# EAGLE design 8ball (EAGLE 8.7.1)
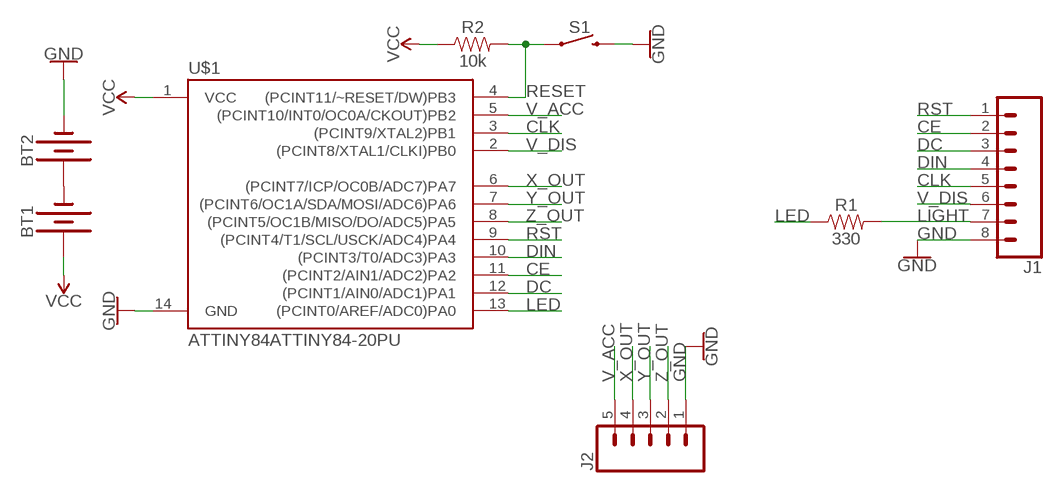
[diagram p0: schematic, sheet 1]

## Parts
BT1  BATTERY-AAA  [BATTERY-AAA]
BT2  BATTERY-AAA  [BATTERY-AAA]
J1  CONN_08FEMALE_LOCK  [1X08_FEMALE_LOCK]
J2  CONN_05LOCK  [1X05_LOCK]
R1  330  330OHM-HORIZ-1/10W-5%  [AXIAL-0.3]
R2  10k  10KOHM-HORIZ-1/6W-5%  [AXIAL-0.3]
S1  MOMENTARY-SWITCH-SPST-PTH-6.0MM-KIT  [TACTILE_SWITCH_PTH_6.0MM_KIT]
U$1  ATTINY84ATTINY84-20PU  [DIP14]

## Nets
CE: J1.2 U$1.11((PCINT2/AIN1/ADC2)PA2)
CLK: J1.5 U$1.3((PCINT9/XTAL2)PB1)
DC: J1.3 U$1.12((PCINT1/AIN0/ADC1)PA1)
DIN: J1.4 U$1.10((PCINT3/T0/ADC3)PA3)
GND: BT2.GND@1(-) J1.8 J2.1 S1.3 U$1.14(GND)
LED: R1.P$1 U$1.13((PCINT0/AREF/ADC0)PA0)
LIGHT: J1.7 R1.P$2
N$1: BT1.GND@1(-) BT2.PWR@1(+)
RESET: R2.P$2 S1.1 U$1.4((PCINT11/~RESET/DW)PB3)
RST: J1.1 U$1.9((PCINT4/T1/SCL/USCK/ADC4)PA4)
V_ACC: J2.5 U$1.5((PCINT10/INT0/OC0A/CKOUT)PB2)
V_DIS: J1.6 U$1.2((PCINT8/XTAL1/CLKI)PB0)
VCC: BT1.PWR@1(+) R2.P$1 U$1.1(VCC)
X_OUT: J2.4 U$1.6((PCINT7/ICP/OC0B/ADC7)PA7)
Y_OUT: J2.3 U$1.7((PCINT6/OC1A/SDA/MOSI/ADC6)PA6)
Z_OUT: J2.2 U$1.8((PCINT5/OC1B/MISO/DO/ADC5)PA5)

## Library data of the parts
BT1 BT2 = SparkFun-Batteries:BATTERY: Battery - Single Cell A variety of battery chemistries, sizes, and footprints. Device List: 20MM_PTH - Coin Cell Battery Holder - 20mm (PTH) <https://www.sparkfun.com/products/783> 6.8MM_PTH - Coin Cell Battery Holder - 6.8MM(SMD) <https://www.digikey.com/product-detail/en/seiko-instruments/MS621FE-FL11E/728-1057-ND/1889208?WT.srch=1&gclid=CNOQ5a6LzdQCFZS2wAodXCkE0g> 12MM_SMD - Coin Cell Battery Holder - 12mm (SMD) <https://www.sparkfun.com/products/10592> 12MM_PTH - Coin Cell Battery Holder - 12mm (PTH) <https://www.sparkfun.com/products/7948> 20MM_SMD - 20mm Coin Cell Battery Holder (SMD) (2 legs) Used on the Big Time Watch Kit <https://www.sparkfun.com/products/11734> 20MM_SMD_4LEGS - Coin Cell Battery Holder - 20mm (SMD) <https://www.sparkfun.com/products/11892> 20MM_SMD_4LEGS_OVERPASTE - Coin Cell Battery Holder - 20mm (SMD) <https://www.sparkfun.com/products/11892> (Over-paste on the legs) 24.5MM_PTH - Coin Cell Battery Holder - 24.5mm (PTH) <https://www.sparkfun.com/products/8863> 9V - 9V Battery Holder - PC Mount Used on the SparkFun SparkPunk Sound Kit <https://www.sparkfun.com/products/11177> and SparkFun SparkPunk Sequencer Kit <https://www.sparkfun.com/products/12707> 18650 - Battery Holder - 18650 (PTH) <https://www.sparkfun.com/products/13113> AA - Battery Holder - 1xAA (PTH) <https://www.sparkfun.com/products/7949> AAA - Battery Holder - 1xAAA (PTH) <https://www.sparkfun.com/products/12718> AA_KIT - Battery Holder - 1xAA (PTH) <https://www.sparkfun.com/products/7949> Special kit package - pads only have exposed copper on one side of the board. AAA_KIT - Battery Holder - 1xAAA (PTH) <https://www.sparkfun.com/products/12718> Special kit package - pads only have exposed copper on one side of the board.; PROD_ID: BATT-08571; SF_SKU: PRT-12718
J1 = SparkFun-Connectors:CONN_08: Multi connection point. Often used as Generic Header-pin footprint for 0.1 inch spaced/style header connections On any of the 0.1 inch spaced packages, you can populate with these: Break Away Headers - Straight <https://www.sparkfun.com/products/116> (PRT-00116) Break Away Male Headers - Right Angle <https://www.sparkfun.com/products/553> (PRT-00553) Female Headers <https://www.sparkfun.com/products/115> (PRT-00115) Break Away Headers - Machine Pin <https://www.sparkfun.com/products/117> (PRT-00117) Break Away Female Headers - Swiss Machine Pin <https://www.sparkfun.com/products/743> (PRT-00743) Arduino Stackable Header - 8 Pin <https://www.sparkfun.com/products/9279> (PRT-09279) For SCREWTERMINALS and SPRING TERMINALS visit here: Screw Terimnals on SparkFun.com <https://www.sparkfun.com/search/results?term=Screw+Terminals> (5mm/3.5mm/2.54mm spacing) This device is also useful as a general connection point to wire up your design to another part of your project. Our various solder wires solder well into these plated through hole pads. Hook-Up Wire - Assortment (Stranded, 22 AWG) <https://www.sparkfun.com/products/11375> (PRT-11375) Hook-Up Wire - Assortment (Solid Core, 22 AWG) <https://www.sparkfun.com/products/11367> (PRT-11367) View the entire wire category on our website here <https://www.sparkfun.com/categories/141> Special notes: Molex polarized connector foot print use with SKU : PRT-08231 with associated crimp pins and housings. 1MM SMD Version SKU: PRT-10208 NOTES ON THE VARIANTS LOCK and LOCK_LONGPADS... This footprint was designed to help hold the alignment of a through-hole component (i.e. 6-pin header) while soldering it into place. You may notice that each hole has been shifted either up or down by 0.005 of an inch from it's more standard position (which is a perfectly straight line). This slight alteration caused the pins (the squares in the middle) to touch the edges of the holes. Because they are alternating, it causes a "brace" to hold the component in place. 0.005 has proven to be the perfect amount of "off-center" position when using our standard breakaway headers. Although looks a little odd when you look at the bare footprint, once you have a header in there, the alteration is very hard to notice. Also,if you push a header all the way into place, it is covered up entirely on the bottom side.; PROD_ID: CONN-09233; SF_ID: PRT-09279
J2 = SparkFun-Connectors:CONN_05: Multi connection point. Often used as Generic Header-pin footprint for 0.1 inch spaced/style header connections On any of the 0.1 inch spaced packages, you can populate with these: Break Away Headers - Straight <https://www.sparkfun.com/products/116> (PRT-00116) Break Away Male Headers - Right Angle <https://www.sparkfun.com/products/553> (PRT-00553) Female Headers <https://www.sparkfun.com/products/115> (PRT-00115) Break Away Headers - Machine Pin <https://www.sparkfun.com/products/117> (PRT-00117) Break Away Female Headers - Swiss Machine Pin <https://www.sparkfun.com/products/743> (PRT-00743) For SCREWTERMINALS and SPRING TERMINALS visit here: Screw Terimnals on SparkFun.com <https://www.sparkfun.com/search/results?term=Screw+Terminals> (5mm/3.5mm/2.54mm spacing) This device is also useful as a general connection point to wire up your design to another part of your project. Our various solder wires solder well into these plated through hole pads. Hook-Up Wire - Assortment (Stranded, 22 AWG) <https://www.sparkfun.com/products/11375> (PRT-11375) Hook-Up Wire - Assortment (Solid Core, 22 AWG) <https://www.sparkfun.com/products/11367> (PRT-11367) View the entire wire category on our website here <https://www.sparkfun.com/categories/141> Special notes: Molex polarized connector foot print use with SKU : PRT-08231 with associated crimp pins and housings. 1MM SMD Version SKU: PRT-10208
R1 = SparkFun-Resistors:330OHM: 330Ω resistor A resistor is a passive two-terminal electrical component that implements electrical resistance as a circuit element. Resistors act to reduce current flow, and, at the same time, act to lower voltage levels within circuits. - Wikipedia; PROD_ID: RES-8371
R2 = SparkFun-Resistors:10KOHM: 10kΩ resistor A resistor is a passive two-terminal electrical component that implements electrical resistance as a circuit element. Resistors act to reduce current flow, and, at the same time, act to lower voltage levels within circuits. - Wikipedia; PROD_ID: RES-08375
S1 = SparkFun-Switches:MOMENTARY-SWITCH-SPST: Momentary Switch (Pushbutton) - SPST Normally-open (NO) SPST momentary switches (buttons, pushbuttons). Variants PTH-12MM - 12mm square, through-hole Momentary Pushbutton Switch - 12mm Square <https://www.sparkfun.com/products/9190> (COM-09190) PTH-6.0MM, PTH-6.0MM-KIT - 6.0mm square, through-hole Mini Pushbutton Switch <https://www.sparkfun.com/products/97> (COM-00097) KIT package intended for soldering kit's - only one side of pads' copper is exposed. PTH-RIGHT-ANGLE-KIT - Right-angle, through-hole Right Angle Tactile Button <https://www.sparkfun.com/products/10791> - Used on SparkFun BigTime Watch Kit <https://www.sparkfun.com/products/11734> SMD-12MM - 12mm square, surface-mount Tactile Button - SMD (12mm) <https://www.sparkfun.com/products/12993> (COM-12993) Used on SparkFun PicoBoard <https://www.sparkfun.com/products/11888> SMD-4.5MM - 4.5mm Square Trackball Switch Used on SparkFun Blackberry Trackballer Breakout <https://www.sparkfun.com/products/13169> SMD-4.6MMX2.8MM - 4.60mm x 2.80mm, surface mount Used on SparkFun SAMD21 Mini Breakout <https://www.sparkfun.com/products/13664> SMD-5.2MM, SMD-5.2-REDUNDANT - 5.2mm square, surface-mount Mini Pushbutton Switch - SMD <https://www.sparkfun.com/products/8720> (COM-08720) Used on Arduino Pro Mini <https://www.sparkfun.com/products/11114> REDUNDANT package connects both switch circuits together SMD-6.0X3.5MM - 6.0 x 3.5mm, surface mount Momentary Reset Switch SMD <https://www.sparkfun.com/products/8229> (COM-08229) SMD-6.2MM-TALL - 6.2mm square, surface mount Tactile Button - SMD (6mm) <https://www.sparkfun.com/products/12992> Used on SparkFun Digital Sandbox <https://www.sparkfun.com/products/12651> SMD-RIGHT-ANGLE - Right-angle, surface mount Used on SparkFun Block for Intel® Edison - Arduino <https://www.sparkfun.com/products/13036>; PROD_ID: SWCH-08441; SF_SKU: COM-00097
U$1 = SparkFun-IC-Microcontroller:ATTINY84: Atmel 14-pin 2/4/8kB flash uC Datasheet <https://cdn.sparkfun.com/datasheets/Widgets/doc8006.pdf> SparkFun Products Tiny AVR Programmer <https://www.sparkfun.com/products/11801> (PGM-11801) SparkFun Servo Trigger - Continuous Rotation <https://www.sparkfun.com/products/13872> (WIG-13872) SparkFun Servo Trigger <https://www.sparkfun.com/products/13118> (WIG-13118)

## Board
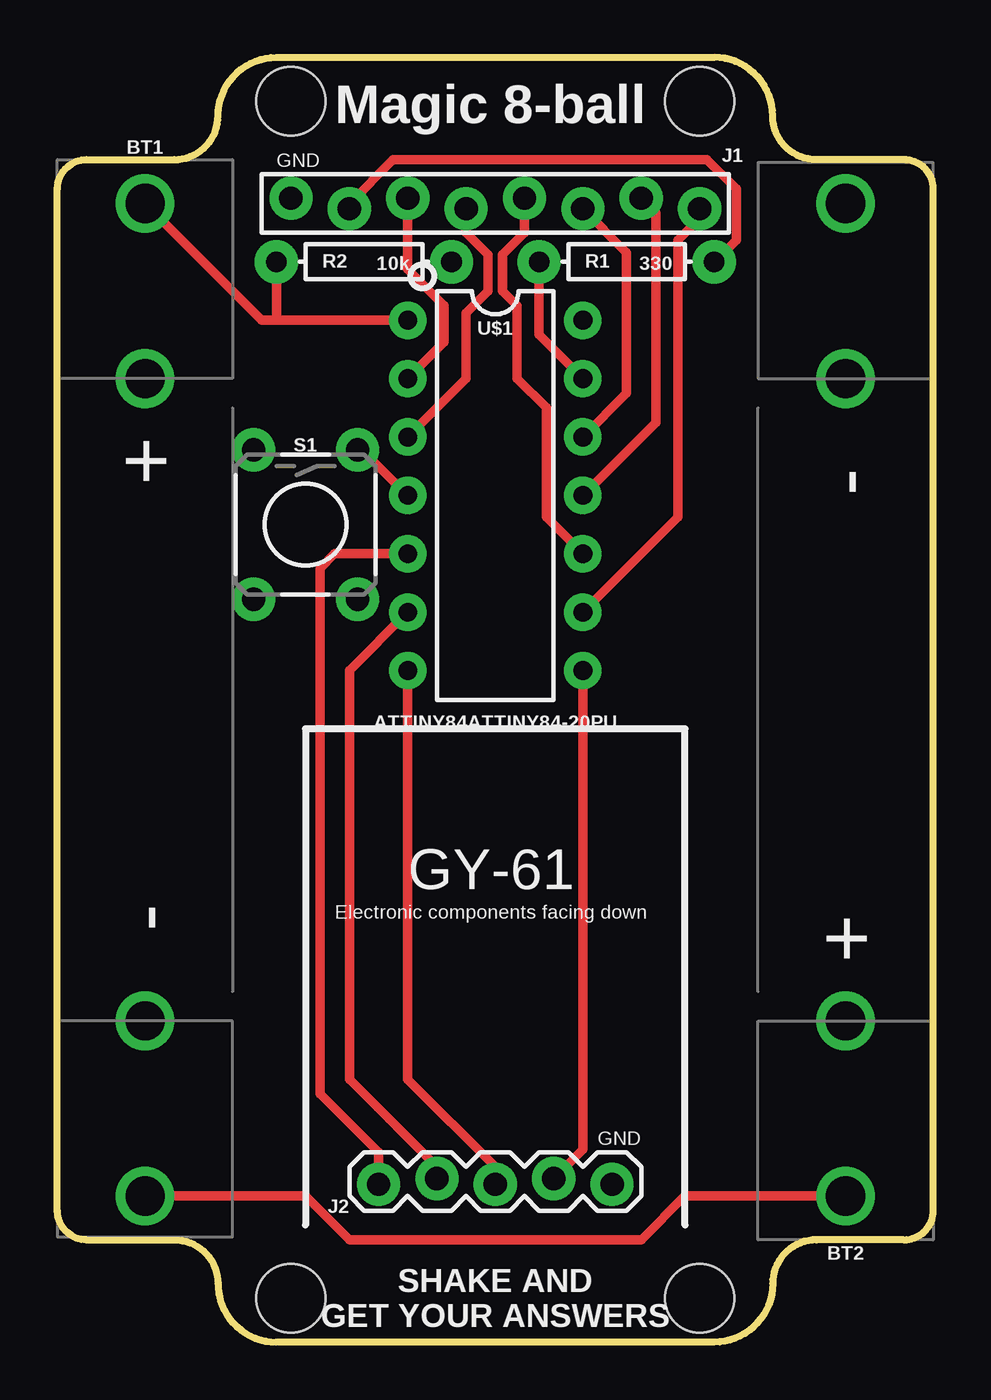
[diagram p1: board, top side]
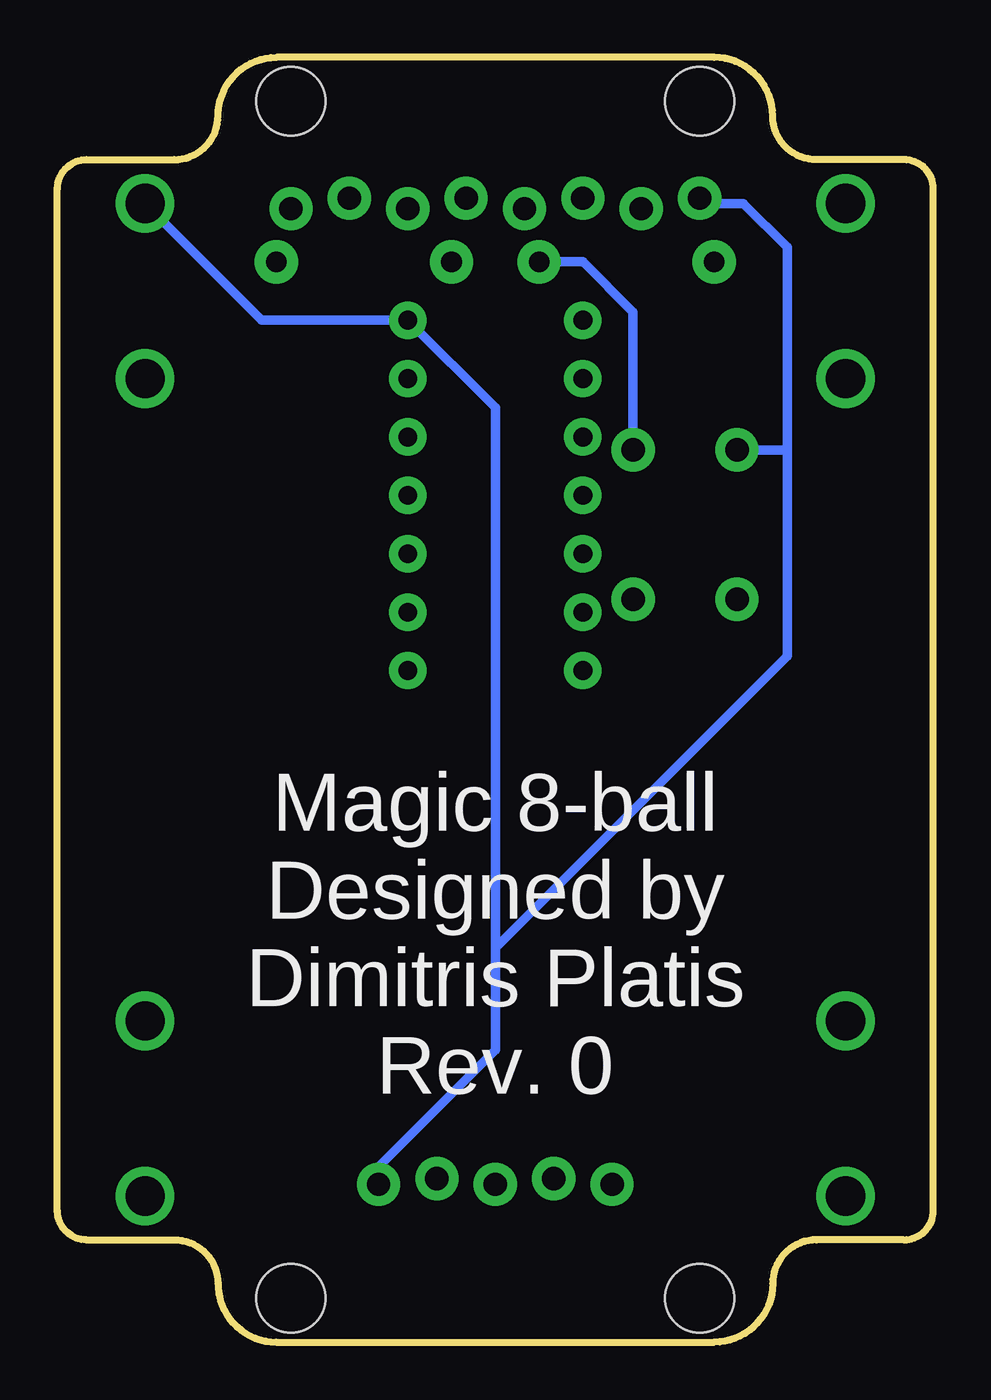
[diagram p2: board, bottom side, seen from below]

Size 38.1 x 55.88 mm. Coordinates in mm from the lower left corner, seen from the top.
Outline: 1.27,51.44 5.08,51.44 arc90 6.98,53.34 arc-90 9.53,55.88 28.58,55.88 arc-90 31.12,53.34 arc90 33.02,51.44 36.83,51.44 arc-90 38.1,50.16 38.1,5.71 arc-90 36.83,4.44 33.02,4.44 arc90 31.12,2.54 arc-90 28.58,0 9.53,0 arc-90 6.98,2.54 arc90 5.08,4.44 1.27,4.44 arc-90 0,5.71 0,50.16 arc-90 1.27,51.44
Copper layers (1*16): Top 0.035mm / dielectric 1.5mm / Bottom 0.035mm
Design rules "SeeedStudio_2layer_DRU_edited": minimum track width 7mil, minimum drill 15mil, track to track 6mil, track to pad 6mil, pad to pad 6mil, via to via 6mil, smd to smd 0mil, copper to edge 10mil, drill to drill 10mil, minimum pad ring 10mil, minimum via ring 6mil, stop-mask expansion 2mil, vias tented up to drill 100mil, thermal gap 10mil
Holes 3 mm at 10.16,53.97 10.16,1.9 27.94,53.97 27.94,1.9

### Footprints (pad centres in the part's own frame; a part is rotated, then mirrored left to right if it is on the bottom)
BATTERY-AAA = drill 1.702: GND@1 21.59,0; GND@2 13.97,0; PWR@1 -21.59,0; PWR@2 -13.97,0
1X08_FEMALE_LOCK = drill 1.016 pad 1.88: 1 0,0.229; 2 2.54,-0.229; 3 5.08,0.229; 4 7.62,-0.229; 5 10.16,0.229; 6 12.7,-0.229; 7 15.24,0.229; 8 17.78,-0.229
1X05_LOCK = drill 1.016 pad 1.88: 1 0,0.127; 2 2.54,-0.127; 3 5.08,0.127; 4 7.62,-0.127; 5 10.16,0.127
AXIAL-0.3 = drill 0.9 pad 1.88: P$1 -3.81,0; P$2 3.81,0
TACTILE_SWITCH_PTH_6.0MM_KIT = drill 1.016 pad 1.88: 1 -3.251,2.261; 2 3.251,2.261; 3 -3.251,-2.261; 4 3.251,-2.261
DIP14 = drill 0.813 pad 1.626: 1 -7.62,-3.81; 2 -5.08,-3.81; 3 -2.54,-3.81; 4 0,-3.81; 5 2.54,-3.81; 6 5.08,-3.81; 7 7.62,-3.81; 8 7.62,3.81; 9 5.08,3.81; 10 2.54,3.81; 11 0,3.81; 12 -2.54,3.81; 13 -5.08,3.81; 14 -7.62,3.81

### Placement (x,y rotation side)
BT1  3.81,27.94 270 top
BT2  34.29,27.94 90 top
J1  27.94,49.53 180 top
J2  24.13,6.98 180 top
R1  24.77,46.99 0 top
R2  13.34,46.99 0 top
S1  10.8,35.56 270 top
U$1  19.05,36.83 270 top

### Tracks (layer width: path | path; a pad name or v marks a point on that pad's centre or on a via)
CE
  Top 0.406: U$1.11 26.04,40 26.04,49.12 J1.2
CLK
  Top 0.406: J1.5 17.78,48.26 18.73,47.31 18.73,45.72 17.78,44.77 17.78,41.91 U$1.3
DC
  Top 0.406: U$1.12 24.77,41.27 24.77,47.4 J1.3
DIN
  Top 0.406: J1.4 20.32,48.26 19.37,47.31 19.37,45.72 20,45.08 20,41.91 21.27,40.64 21.27,35.88 U$1.10
GND
  Bottom 0.406: 19.05,17.14 19.05,40.64 U$1.14 29.21,44.45 BT2.GND@1 | 19.05,17.14 19.05,12.7 24.13,7.62 J2.1 | J1.8 9.93,49.53 8.26,49.53 6.35,47.62 6.35,38.73 | 6.35,38.73 6.35,29.84 19.05,17.14 | 6.35,38.73 6.43,38.81 S1.3
LED
  Top 0.406: U$1.13 20.96,43.81 R1.P$1
LIGHT
  Top 0.406: R1.P$2 29.53,47.94 29.53,50.16 28.26,51.44 14.61,51.44 12.7,49.53 J1.7
N$1
  Top 0.406: BT1.GND@1 10.8,6.35 12.7,4.44 25.4,4.44 27.31,6.35 BT2.PWR@1
RESET
  Top 0.406: U$1.4 13.26,38.81 S1.1
  Bottom 0.406: R2.P$2 15.24,46.99 13.06,44.81 S1.1 13.26,38.81
RST
  Top 0.406: U$1.9 26.99,35.88 26.99,47.94 27.94,48.89 J1.1
V_ACC
  Top 0.406: U$1.5 12.07,34.29 11.43,33.66 11.43,10.8 13.97,8.25 J2.5
V_DIS
  Top 0.406: J1.6 15.24,46.67 16.83,45.08 16.83,43.5 U$1.2
VCC
  Top 0.406: 9.53,44.45 8.89,44.45 BT1.PWR@1 | 9.53,44.45 U$1.1 | R2.P$1 9.53,44.45
X_OUT
  Top 0.406: U$1.6 12.7,29.21 12.7,11.43 16.51,7.62 J2.4
Y_OUT
  Top 0.406: U$1.7 15.24,11.43 19.05,7.62 J2.3
Z_OUT
  Top 0.406: J2.2 22.86,8.38 U$1.8

### Text on the board
tPlace: Magic 8-ball | GND | GY-61 | Electronic components facing down | GND | SHAKE AND / GET YOUR ANSWERS
bPlace: Magic 8-ball / Designed by / Dimitris Platis / Rev. 0